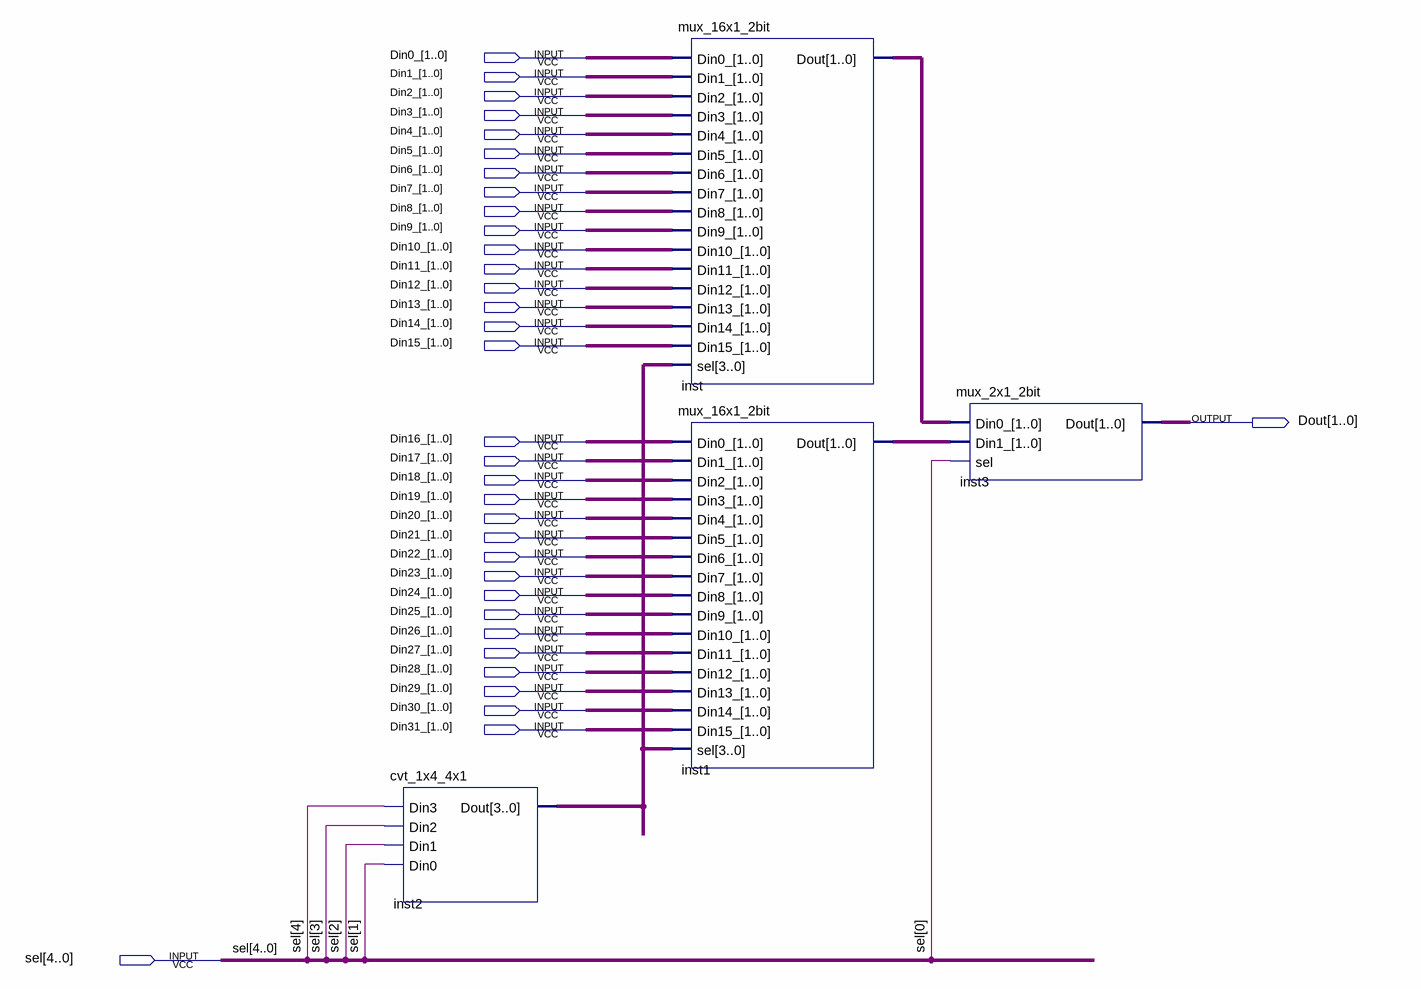
[diagram p0: schematic sheet]
// Quartus schematic mux_32x1_2bit.bdf as structural Verilog: 4 symbols, 34 pins
module mux_32x1_2bit (
  input  [1:0] Din0_,
  input  [1:0] Din1_,
  input  [1:0] Din2_,
  input  [1:0] Din3_,
  input  [1:0] Din4_,
  input  [1:0] Din5_,
  input  [1:0] Din6_,
  input  [1:0] Din7_,
  input  [1:0] Din8_,
  input  [1:0] Din9_,
  input  [1:0] Din10_,
  input  [1:0] Din11_,
  input  [1:0] Din12_,
  input  [1:0] Din13_,
  input  [1:0] Din14_,
  input  [1:0] Din15_,
  input  [1:0] Din16_,
  input  [1:0] Din17_,
  input  [1:0] Din18_,
  input  [1:0] Din19_,
  input  [1:0] Din20_,
  input  [1:0] Din21_,
  input  [1:0] Din22_,
  input  [1:0] Din23_,
  input  [1:0] Din24_,
  input  [1:0] Din25_,
  input  [1:0] Din26_,
  input  [1:0] Din27_,
  input  [1:0] Din28_,
  input  [1:0] Din29_,
  input  [1:0] Din30_,
  input  [1:0] Din31_,
  input  [4:0] sel,
  output [1:0] Dout
);

  wire [1:0] inst1_dout, inst_dout;
  wire [3:0] inst2_dout;

  cvt_1x4_4x1 inst2 (.Din3(sel[4]), .Din2(sel[3]), .Din1(sel[2]), .Din0(sel[1]), .Dout(inst2_dout));
  mux_16x1_2bit inst (
    .Din0_(Din0_), .Din1_(Din1_), .Din2_(Din2_), .Din3_(Din3_), .Din4_(Din4_), .Din5_(Din5_), .Din6_(Din6_),
    .Din7_(Din7_), .Din8_(Din8_), .Din9_(Din9_), .Din10_(Din10_), .Din11_(Din11_), .Din12_(Din12_),
    .Din13_(Din13_), .Din14_(Din14_), .Din15_(Din15_), .sel(inst2_dout), .Dout(inst_dout));
  mux_16x1_2bit inst1 (
    .Din0_(Din16_), .Din1_(Din17_), .Din2_(Din18_), .Din3_(Din19_), .Din4_(Din20_), .Din5_(Din21_),
    .Din6_(Din22_), .Din7_(Din23_), .Din8_(Din24_), .Din9_(Din25_), .Din10_(Din26_), .Din11_(Din27_),
    .Din12_(Din28_), .Din13_(Din29_), .Din14_(Din30_), .Din15_(Din31_), .sel(inst2_dout), .Dout(inst1_dout));
  mux_2x1_2bit inst3 (.Din0_(inst_dout), .Din1_(inst1_dout), .sel(sel[0]), .Dout(Dout));
endmodule
